# Altium project ESP32C_RF.PrjPcb
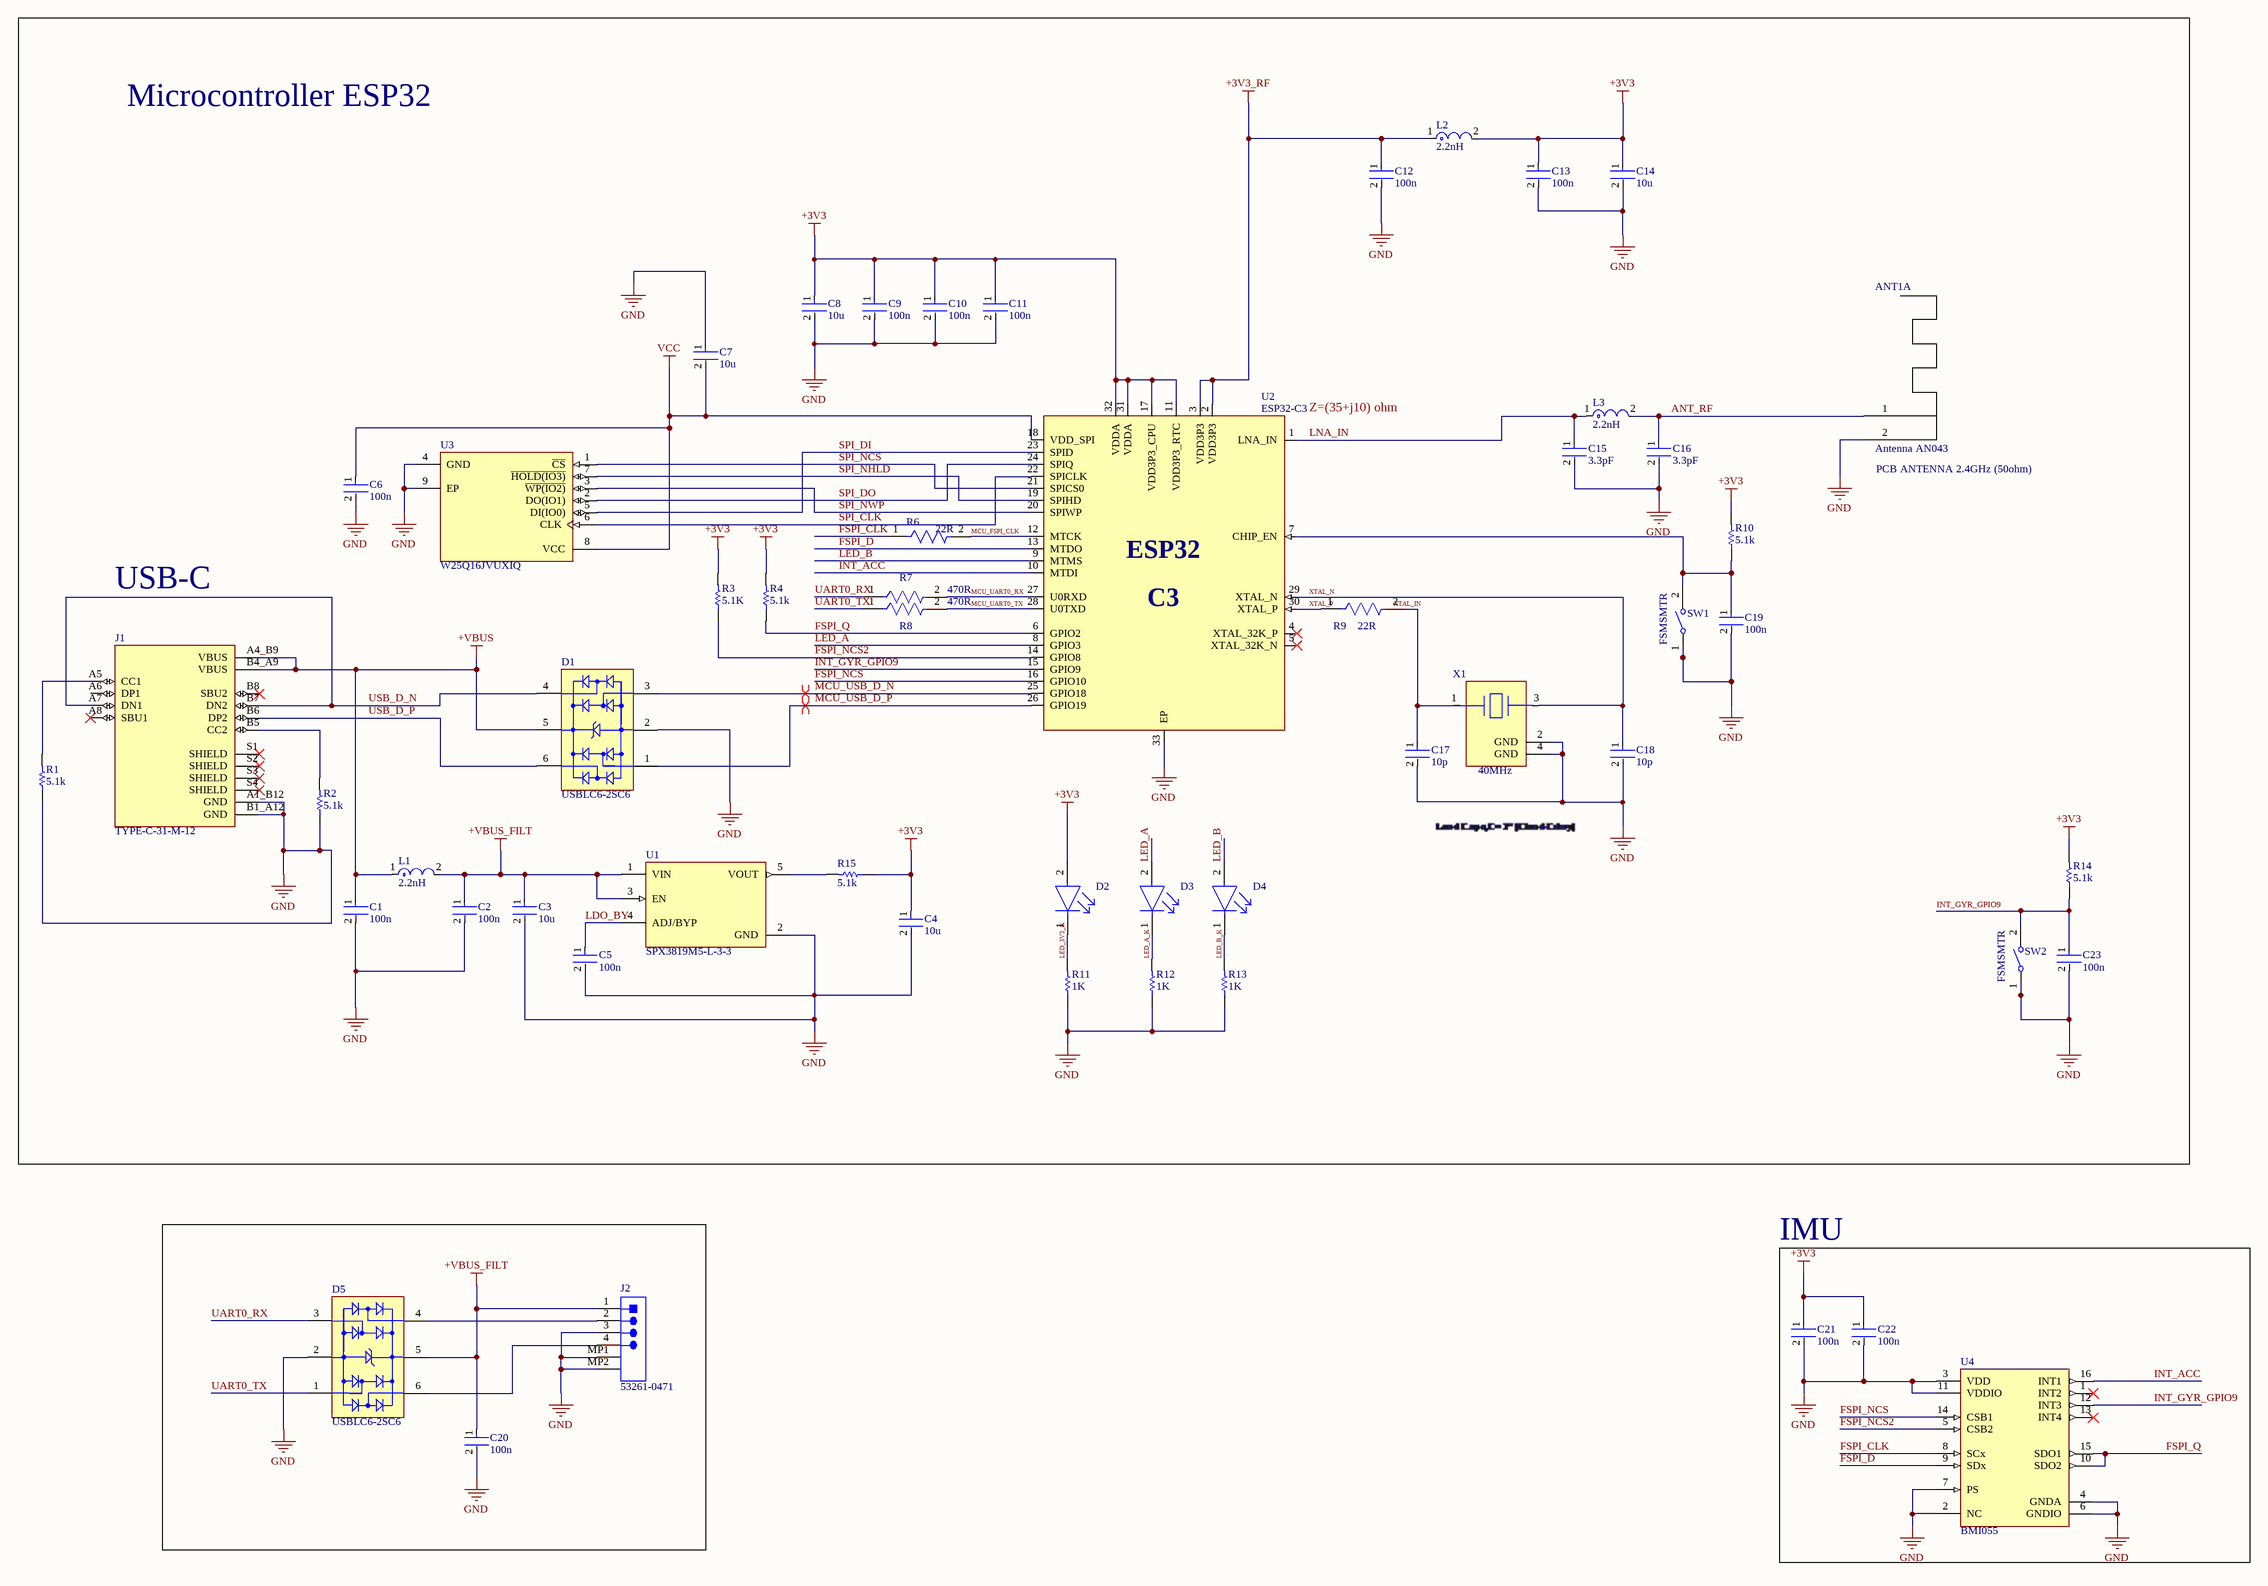
[diagram p0: ESP32C_RF.SchDoc]
1 sheet, 55 parts. Net scope: global (net labels, ports and power ports of the same name join across sheets).
Board file: ESP32C_RF.PcbDoc

## Sheet ESP32C_RF.SchDoc
size C; SheetNumber: 1; SheetTotal: 1

### Parts
ANT1  Antenna AN043  [Antenna_AN043]  (part A of 3)
C1  100n  [FP-C0402-BB-MFG]
C2  100n  [FP-C0402-BB-MFG]
C3  10u  [FP-0603-L_1_6_0_15-W_0_81-MFG]
C4  10u  [FP-0603-L_1_6_0_15-W_0_81-MFG]
C5  100n  [FP-C0402-BB-MFG]
C6  100n  [FP-C0402-BB-MFG]
C7  10u  [FP-0603-L_1_6_0_15-W_0_81-MFG]
C8  10u  [FP-0603-L_1_6_0_15-W_0_81-MFG]
C9  100n  [FP-C0402-BB-MFG]
C10  100n  [FP-C0402-BB-MFG]
C11  100n  [FP-C0402-BB-MFG]
C12  100n  [FP-C0402-BB-MFG]
C13  100n  [FP-C0402-BB-MFG]
C14  10u  [FP-0603-L_1_6_0_15-W_0_81-MFG]
C15  3.3pF  [FP-C0402-BB-MFG]
C16  3.3pF  [FP-C0402-BB-MFG]
C17  10p  [FP-C0402-BB-MFG]
C18  10p  [FP-C0402-BB-MFG]
C19  100n  [FP-C0402-BB-MFG]
C20  100n  [FP-C0402-BB-MFG]
C21  100n  [FP-C0402-BB-MFG]
C22  100n  [FP-C0402-BB-MFG]
C23  100n  [FP-C0402-BB-MFG]
D1  USBLC6-2SC6  [STM-SOT23-6L_V]
D2  LTST-C190KRKT  [FP-LTST-C190KRKT-MFG]  (value not drawn)
D3  LTST-C190KRKT  [FP-LTST-C190KRKT-MFG]  (value not drawn)
D4  LTST-C190KRKT  [FP-LTST-C190KRKT-MFG]  (value not drawn)
D5  USBLC6-2SC6  [STM-SOT23-6L_V]
J1  TYPE-C-31-M-12  [HRO_TYPE-C-31-M-12]
J2  53261-0471  [MOLEX-53261-0471_V]
L1  2.2nH  [FP-LQG15HH_02-IPC_A]
L2  2.2nH  [FP-LQG15HH_02-IPC_A]
L3  2.2nH  [FP-LQG15HH_02-IPC_A]
R1  5.1k  [RESC1005X40X25LL05T05]
R2  5.1k  [RESC1005X40X25LL05T05]
R3  5.1K  [RESC1005X40X25LL05T05]
R4  5.1k  [RESC1005X40X25LL05T05]
R6  22R  [FP-CRCW0402-e3-IPC_C]
R7  470R  [FP-ERJ2RK-IPC_C]
R8  470R  [FP-ERJ2RK-IPC_C]
R9  22R  [FP-CRCW0402-e3-IPC_C]
R10  5.1k  [RESC1005X40X25LL05T05]
R11  1K  [RESC1005X40X25LL05T05]
R12  1K  [RESC1005X40X25LL05T05]
R13  1K  [RESC1005X40X25LL05T05]
R14  5.1k  [RESC1005X40X25LL05T05]
R15  5.1k  [RESC1005X40X25LL05T05]
SW1  FSMSMTR  [TECO-FSMSMTR_V]
SW2  FSMSMTR  [TECO-FSMSMTR_V]
U1  SPX3819M5-L-3-3  [SOT95P280X145-5N]
U2  ESP32-C3  [QFN50P500X500X90-33N-D]
U3  W25Q16JVUXIQ  [FP-UX-MFG]
U4  BMI055  [FP-BMI055-MFG]
X1  40MHz  [FP-NX2520SA-MFG]

### Blocks framed on the sheet
IMU: C21 C22 U4

### Nets
+3V3: C4.1 C8.1 C9.1 C10.1 C11.1 C13.1 C14.1 C21.1 C22.1 D2.2(A) L2.2 R3.2 R4.2 R10.2 R14.2 R15.1 U2.11(VDD3P3_RTC) U2.17(VDD3P3_CPU) U2.31(VDDA) U2.32(VDDA)
+3V3_RF: C12.1 L2.1 U2.2(VDD3P3) U2.3(VDD3P3)
+VBUS: C1.1 D1.5(VBUS) J1.A4_B9(VBUS) J1.B4_A9(VBUS) L1.1
+VBUS_FILT: C2.1 C3.1 C20.1 D5.5(VBUS) J2.1 L1.2 U1.1(VIN) U1.3(EN)
GND: ANT1.2(GND) C1.2 C2.2 C3.2 C4.2 C5.2 C6.2 C7.1 C8.2 C9.2 C10.2 C11.2 C12.2 C13.2 C14.2 C15.2 C16.2 C17.2 C18.2 C19.2 C20.2 C21.2 C22.2 C23.2 D1.2(GND) D5.2(GND) J1.A1_B12(GND) J1.B1_A12(GND) J2.3 J2.MP1 J2.MP2 R1.1 R2.1 R11.1 R12.1 R13.1 SW1.1 SW2.1 U1.2(GND) U2.33(EP) U3.4(GND) U3.9(EP) U4.2(NC) U4.3(VDD) U4.4(GNDA) U4.6(GNDIO) U4.7(PS) U4.11(VDDIO) X1.2(GND) X1.4(GND)
VCC: C6.1 C7.2 U2.18(VDD_SPI) U3.8(VCC)
ANT_RF: ANT1.1(Antenna) C16.1 L3.2
FSPI_CLK: R6.1 U4.8(SCx)
FSPI_D: U2.13(MTDO) U4.9(SDx)
FSPI_NCS: U2.16(GPIO10) U4.14(CSB1)
FSPI_NCS2: R3.1 U2.14(GPIO8) U4.5(CSB2)
FSPI_Q: R4.1 U2.6(GPIO2) U4.10(SDO2) U4.15(SDO1)
INT_ACC: U2.10(MTDI) U4.16(INT1)
INT_GYR_GPIO9: C23.1 R14.1 SW2.2 U2.15(GPIO9) U4.12(INT3)
LDO_BY: C5.1 U1.4(ADJ/BYP)
LED_3V3_K: D2.1(C) R11.2
LED_A: D3.2(A) U2.8(GPIO3)
LED_A_K: D3.1(C) R12.2
LED_B: D4.2(A) U2.9(MTMS)
LED_B_K: D4.1(C) R13.2
LNA_IN: C15.1 L3.1 U2.1(LNA_IN)
MCU_FSPI_CLK: R6.2 U2.12(MTCK)
MCU_UART0_RX: R7.2 U2.27(U0RXD)
MCU_UART0_TX: R8.2 U2.28(U0TXD)
MCU_USB_D_N: D1.3(I/O_2) U2.25(GPIO18)
MCU_USB_D_P: D1.1(I/O_1) U2.26(GPIO19)
SPI_CLK: U2.22(SPICLK) U3.6(CLK)
SPI_DI: U2.23(SPID) U3.5(DI(IO0))
SPI_DO: U2.24(SPIQ) U3.2(DO(IO1))
SPI_NCS: U2.21(SPICS0) U3.1(~{CS})
SPI_NHLD: U2.19(SPIHD) U3.7(~{HOLD(IO3)})
SPI_NWP: U2.20(SPIWP) U3.3(~{WP(IO2)})
UART0_RX: D5.3(I/O_2) R7.1
UART0_TX: D5.1(I/O_1) R8.1
USB_D_N: D1.4(I/O_3) J1.A7(DN1) J1.B7(DN2)
USB_D_P: D1.6(I/O_4) J1.B6(DP2)
XTAL_N: C18.1 U2.29(XTAL_N) X1.3
XTAL_P: R9.1 U2.30(XTAL_P)
NetC17_1: C17.1 R9.2 X1.1
NetC19_1: C19.1 R10.1 SW1.2 U2.7(CHIP_EN)
NetD5_4: D5.4(I/O_3) J2.2
NetD5_6: D5.6(I/O_4) J2.4
NetJ1_A5: J1.A5(CC1) R1.2
NetJ1_B5: J1.B5(CC2) R2.2
NetR15_2: R15.2 U1.5(VOUT)

Not connected (* = marked no-connect by the designer): J1 A6(DP1) A8(SBU1)* B8(SBU2)* S1(SHIELD)* S2(SHIELD)* S3(SHIELD)* S4(SHIELD)*; U2 4(XTAL_32K_P)* 5(XTAL_32K_N)*; U4 1(INT2)* 13(INT4)*

### Layout directives
differential pair: MCU_USB_D_N, MCU_USB_D_P

### Notes on the sheet
- Microcontroller ESP32
- (near U2) Z=(35+j10) ohm
- (near ANT1) PCB ANTENNA 2.4GHz (50ohm)
- USB-C
- Labels drawn without touching a wire or pin: XTAL_IN
- (in symbol ESP32-C3) ESP32; C3

### Library data of the parts
C1 C2 C5 C6 C9-C13 C15-C23 = CMP-2008-02046-2: CAP CER 0.1UF 10V X5R 0402; Manufacturer: Kemet; Manufacturer Part Number: C0402C104K8PACTU; Material: Ceramic; Capacitance: 0.10 μF; Temperature Coefficient: 15%; Tolerance: 0.1; Value: 0.10 μF; Package: C0402-BB; Temperature: -55°C to +125°C; ComponentLink2Description: Datasheet; Temperature Characteristic: X5R; Device Class L1: Passive Components; Height: 0.55mm; Lead Free: Yes; ComponentLink2URL: https://content.kemet.com/datasheets/KEM_C1002_X7R_SMD.pdf; Device Class L2: Capacitors; Temperature Range Low: -55°C; Temperature Range High: +125°C; RoHS: TRUE; Octopart: https://octopart.com/c0402c104k8pactu-kemet-140039; Automotive: No; Mouser Description: Capacitor 100 nF 10 VDC 0402; Category: Cap; Voltage Rating: 10 V; Digikey Description: CAP CER 0.1UF 10V X5R 0402; Ipc Land Pattern Name: CAPC10050X50; Device Class L3: Ceramic Capacitors
C3 C4 C7 C8 C14 = CMP-1035-02592-4: General Purpose Ceramic Capacitor, 0603, 100nF, 10%, X7R, 15%, 50V; Dissipation Factor: 2.5%; Radiation Hardening: No; Termination: SMD/SMT; Tolerance: 10%; Lead Free: Lead Free; Width: 0.81mm; Max Operating Temperature: 125°C; Thickness: 0.035inch; Voltage Rating: 50V; Height: 0.9mm; Case/Package: 0603; Depth: 0.81mm; Number of Pins: 2; Capacitance: 100nF; REACH SVHC: No SVHC; Case Code (Imperial): 0603; Voltage: 50V; Voltage Rating (DC): 50V; Mount: Surface Mount; Length: 1.6mm; Min Operating Temperature: -55°C; Packaging: Tape and Reel; Case Code (Metric): 1608; Dielectric Material: Ceramic; Package Quantity: 1; Dielectric: X7R; Contact Plating: Tin
D1 D5 = CMP-2000-05378-1: Very low capacitance ESD protection, 3.5 pF, -40 to 125 degC, 6-Pin SOT23, RoHS, Tape and Reel; Manufacturer: STMicroelectronics; Polarity: Uni-Directional; Clamping Voltage: 17V; Rad Hardened: No; Product Height (mm): 1.3mm; Leakage Current (Max): 0.15uA; Product Length (mm): 3.05mm; Number of Elements: 1; Peak Pulse Current: 5A; Configuration: Dual; Reverse Breakdown Voltage: 6V; Working Voltage (Max): 5V; Capacitance Value: 3.5pF; Suppressor Type: DiodeArrays; Product Depth (mm): 1.75mm; Test Current (It): 1mA; Package / Case: SOT-23; Operating Temperature Max Deg. C: 125C; Package Description: 6-Pin Small Outline Transistor, Body 2.925 x 1.625 mm, Pitch 0.95 mm; Package Reference: SOT23-6L; Datasheet Version: Rev. 5, 10/2011; Operating Temperature Min Deg. C: -40C; Mounting Style: SurfaceMount; Direction Type: Uni-Directional; Mounting: SurfaceMount; Pin Count: 6; Leakage Current: 0.15uA; Packaging: TapeandReel; Operating Temperature Classification: Automotive; Clamping Voltage (Max): 17V; Manufacturer URL: http://www.st.com/; Reverse Stand-off Voltage: 5V; Datasheet URL: http://www.st.com/st-web-ui/static/active/en/resource/technical/document/datasheet/CD00050750.pdf; Working Voltage: 5V; Operating Temp Range: -40Cto125C
D2-D4 = CMP-1674-00011-2: LED RED CLEAR CHIP SMD; Reverse Voltage: 5V; Viewing Angle: 130°; Power Rating: 75mW; Test Current: 20mA; Number of Elements: 1; Lens Color: Colorless; Wavelength: 639nm; Dominant Wavelength: 631nm; Lens Style: Diffused; Forward Current: 30mA; Forward Voltage: 2.4V; Luminous Intensity: 54mcd; Color: Red; Case Code (Imperial): 0603; Lens Transparency: Clear; Lead Free: Lead Free; Package Quantity: 1; Packaging: Tape and Reel; Max Operating Temperature: 85°C; Number of Pins: 2; Height: 0.8mm; Case/Package: 0603; Number of LEDs: 1; Width: 0.8mm; Case Code (Metric): 1608; Depth: 0.8mm; Mount: Surface Mount; Radiation Hardening: No; Length: 1.6mm; Illumination Color: Red; Power Dissipation: 75mW; Min Operating Temperature: -55°C
J1 = TYPE-C-31-M-12: USB Connectors 24 Receptacle 1 8.94*7.3mm RoHS; MF: HRO Electronics Co., Ltd.; Price: None; Value: *; SnapEDA_Link: https://www.snapeda.com/parts/TYPE-C-31-M-12/HRO+Electronics+Co.%252C+Ltd./view-part/?ref=snap; Package: Package; Availability: Not in stock; Check_prices: https://www.snapeda.com/parts/TYPE-C-31-M-12/HRO+Electronics+Co.%252C+Ltd./view-part/?ref=eda; MP: TYPE-C-31-M-12
J2 = CMP-2000-05238-1: Male Header, Pitch 1.25 mm, 1 x 4 Position, Height 3.4 mm, -40 to 85 degC, RoHS, Tape and Reel; Current Rating: 1A; Brand: Molex; Number of Positions / Contacts: 4; Pitch: 1.25mm; Voltage Rating: 125V; Mounting Angle: Right; Manufacturer URL: http://www.molex.com/; Factory Pack Quantity: 1000; Housing Material: Thermoplastic; Datasheet URL: http://www.molex.com/pdm_docs/sd/532610471_sd.pdf; Tradename: PicoBlade; Product Type: Headers; Contact Plating: Tin; Contact Material: PhosphorBronze; Package Description: 1.25mm Pitch PicoBlade(TM) Header, Surface Mount, Right Angle, Lead-Free, 4 Circuits; Mounting Style: SMD/SMT; Manufacturer: Molex; Series: 53261; Packaging: Reel; Number of Rows: 1; RoHS: Details; Number of Positions: 4; Product Category: Headers&WireHousings; Datasheet Version: Rev. G, 01/2012; Type: Shrouded; Termination Style: SMD
L1-L3 = CMP-06042-011103-1: Multilayer type RF Inductor 3.6nH ±0.3nH 0.13Ω 700mA 0402; DC Resistance (DCR): 190mR; Q Factor: 8; Test Frequency: 100MHz; Current: 300mA; Self Resonant Frequency: 6GHz; Core Material: Air; Shielding: Unshielded; Radiation Hardening: No; Packaging: Tape and Reel; Number of Pins: 2; Max Operating Temperature: 125°C; Min Operating Temperature: -55°C; Military Standard: Not; Height - Seated (Max): 0.022inch; Width: 0.5mm; REACH SVHC: No SVHC; Height: 0.5mm; Inductance: 3.6nH; Depth: 0.55mm; Case/Package: 0402; Mount: Surface Mount; Length: 0.039inch; Termination: SMD/SMT; DC Current: 300mA; Current Rating: 300mA; Max DC Current: 300mA; Lead Free: Lead Free; Case Code (Imperial): 0402; Package Quantity: 10000; Case Code (Metric): 1005
R1-R4 R10-R15 = CMP-2002-08382-1: Manufacturer: Vishay Dale; Part Number: CRCW040222R0FKED
R6 R9 = CMP-1011-00397-3: RES Thick Film, 100Ω, 1%, 0.063W, 100ppm/°C, 0402; Max Power Dissipation: 63mW; Voltage Rating: 50V; Resistance: 100R; Package Quantity: 10; Lead Free: Lead Free; Termination: SMD/SMT; Case Code (Metric): 1005; Number of Terminations: 2; Composition: Thick Film; Voltage Rating (DC): 50V; Min Operating Temperature: -55°C; Case/Package: 0402; Radiation Hardening: No; Max Operating Temperature: 155°C; Temperature Coefficient: 100ppm/°C; Military Standard: Not; Length: 1mm; Mount: Surface Mount; Power Rating: 63mW; Weight: 2.3E-05oz; Working Voltage: 50V; Features: Automotive AEC-Q200; Depth: 0.5mm; Packaging: Tape and Reel; Tolerance: 1%; Height: 0.35mm; Case Code (Imperial): 0402; Width: 0.02inch; Contact Plating: Tin
R7 R8 = CMP-2002-01153-2: RES SMD 470 OHM 1% 1/10W 0402; Temperature Coefficient: 100ppm/°C; Max Power Dissipation: 100mW; Voltage Rating: 50V; Contact Plating: Tin; Resistance: 470R; Technology: THICK FILM; Radiation Hardening: No; Number of Pins: 2; Height: 0.35mm; Packaging: Tape and Reel; Length: 1mm; Width: 0.02inch; Power Rating: 100mW; Max Operating Temperature: 155°C; Military Standard: Not; Features: Automotive AEC-Q200; Min Operating Temperature: -55°C; Resistance Tolerance: 1%; Resistor Type: Thick Film; Termination: SMD/SMT; Tolerance: 1%; Series: ERJ; Case/Package: 0402; RoHS Compliant: Yes; Lead Free: Lead Free; Number of Terminations: 2; Case Code (Imperial): 0402; Depth: 0.5mm; Weight: 2.8E-05oz; Voltage Rating (DC): 50V; Package Quantity: 1; Case Code (Metric): 1005; Construction: Rectangular; Mount: Surface Mount
SW1 SW2 = CMP-2000-07501-1: FSMSM Push Button Switch, 50 mA, -35 to 85 degC, 2-Pin SMD, RoHS, Tape and Reel; Manufacturer: TE Connectivity; Voltage Rating (DC): 24V; Electrical Life: 20000Cycles; Operating Force: 180gf; Switch Travel: 0.25mm; Contact Current Rating: 50mA; Case\/Package: SMD/SMT; Actuator Length: 1.07mm; Throw Configuration: SPST; Actuator Material: Polyamide; Contact Resistance: 100mOhm; Illumination Type: Illuminated; Max Voltage Rating (DC): 12V; Manufacturer URL: http://www.te.com/; Lead Free: LeadFree; Packaging: TapeandReel; Min Operating Temperature: -35degC; Mechanical Life: 20000Cycles; Mount: SurfaceMount; REACH SVHC: Unknown; Package Quantity: 1800; Package Reference: FSMSMTR; RoHSCompliant: true; Max Operating Temperature: 85degC; Orientation: Straight; ELV: Compliant; Datasheet URL: http://www.te.com/commerce/DocumentDelivery/DDEController?Action=showdoc&DocId=Customer+Drawing%7F1437566-3%7FC2%7Fpdf%7FEnglish%7FENG_CD_1437566-3_C2_1437566_3_1_c.dwg.pdf%7F1437566-4; Package Description: 2-Pin Surface Mount Device, Body 6 x 3.5 mm, Pitch 9.19 mm; Current Rating: 50mA; Contact Plating: Silver; Termination: GullWing; Datasheet Version: Rev. C2, 08/2014; Contact Material: Brass; Mounting Technology: SurfaceMount
U1 = SPX3819M5-L-3-3: Linear Voltage Regulator IC Positive Fixed 1 Output 500mA SOT-23-5; MF: MaxLinear, Inc.; MP: SPX3819M5-L-3-3/TR; SnapEDA_Link: https://www.snapeda.com/parts/SPX3819M5-L-3-3/TR/MaxLinear%252C+Inc./view-part/?ref=snap; Package: SOT-23-5 Exar; Value: *; Check_prices: https://www.snapeda.com/parts/SPX3819M5-L-3-3/TR/MaxLinear%252C+Inc./view-part/?ref=eda
U2 = ESP32-C3: Ultra­Low­Power SoC with RISC­V Single­Core CPU Supporting IEEE 802.11b/g/n (2.4 GHz Wi­Fi) and Bluetooth® 5 (LE); Manufacturer: Espressif; Manufacturer Part Number: ESP32-C3; LCSC: C2838500
U3 = CMP-78876-000011-1: IC FLASH 16MBIT SPI/QUAD 8USON; RoHS Compliant: Yes
U4 = CMP-191067-000009-1: IMU ACCEL/GYRO I2C/SPI 16LGA; Axis: X, Y, Z; Sensor Type: Accelerometer; Output Type: SPI; Sensitivity: 128LSB/g; Interface: I2C; Bandwidth: 8Hz; Mount: Surface Mount; Case/Package: LGA; Lead Free: Lead Free; Max Operating Temperature: 85°C; Packaging: Tape and Reel; Min Operating Temperature: -40°C; Number of Pins: 16; Package Quantity: 5000
X1 = CMP-2000-05279-2: CRYSTAL 16.0000MHZ 8PF SMD; Series Resistance: 80R; Frequency: 16MHz; Frequency Tolerance: 15ppm; Frequency Stability: 25ppm; Mount: Surface Mount; Height: 0.022inch; Length: 0.098inch; ESR (Equivalent Series Resistance): 80R; Packaging: Tape and Reel; Min Operating Temperature: -40°C; Width: 0.079inch; Number of Pins: 4; Case/Package: SMD/SMT; Max Operating Temperature: 85°C; Load Capacitance: 8pF; Package Quantity: 3000